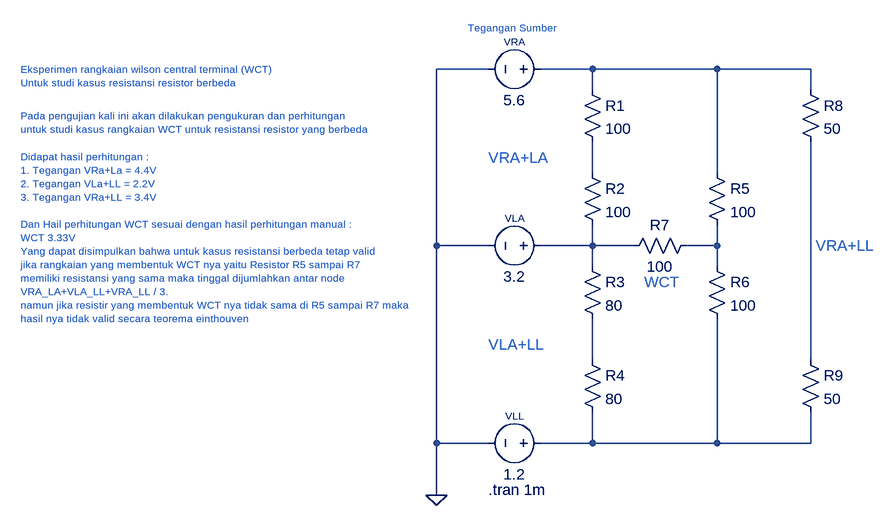
[diagram p0: schematic WCT_dengan_Resistansi_Berbeda.asc]
WCT_dengan_Resistansi_Berbeda.asc, the LTspice schematic file:
Version 4
SHEET 1 880 772
WIRE -96 96 -176 96
WIRE 64 96 -16 96
WIRE 256 96 64 96
WIRE 400 96 256 96
WIRE 64 128 64 96
WIRE 400 128 400 96
WIRE 64 256 64 208
WIRE 256 256 256 96
WIRE -176 368 -176 96
WIRE -96 368 -176 368
WIRE 64 368 64 336
WIRE 64 368 -16 368
WIRE 128 368 64 368
WIRE 256 368 256 336
WIRE 256 368 208 368
WIRE 64 400 64 368
WIRE 256 400 256 368
WIRE 64 544 64 480
WIRE 400 544 400 208
WIRE -176 672 -176 368
WIRE -96 672 -176 672
WIRE 64 672 64 624
WIRE 64 672 -16 672
WIRE 256 672 256 480
WIRE 256 672 64 672
WIRE 400 672 400 624
WIRE 400 672 256 672
WIRE -176 752 -176 672
FLAG -176 752 0
SYMBOL res 48 112 R0
SYMATTR InstName R1
SYMATTR Value 100
SYMBOL res 48 240 R0
SYMATTR InstName R2
SYMATTR Value 100
SYMBOL res 48 384 R0
SYMATTR InstName R3
SYMATTR Value 80
SYMBOL res 48 528 R0
SYMATTR InstName R4
SYMATTR Value 80
SYMBOL res 240 240 R0
SYMATTR InstName R5
SYMATTR Value 100
SYMBOL res 240 384 R0
SYMATTR InstName R6
SYMATTR Value 100
SYMBOL res 224 352 R90
WINDOW 0 0 56 VBottom 2
WINDOW 3 32 56 VTop 2
SYMATTR InstName R7
SYMATTR Value 100
SYMBOL res 384 112 R0
SYMATTR InstName R8
SYMATTR Value 50
SYMBOL res 384 528 R0
SYMATTR InstName R9
SYMATTR Value 50
SYMBOL voltage 0 96 R90
WINDOW 0 -32 56 VBottom 1
WINDOW 3 32 56 VTop 2
SYMATTR InstName VRA
SYMATTR Value 5.6
SYMBOL voltage 0 368 R90
WINDOW 0 -32 56 VBottom 1
WINDOW 3 32 56 VTop 2
SYMATTR InstName VLA
SYMATTR Value 3.2
SYMBOL voltage 0 672 R90
WINDOW 0 -32 56 VBottom 1
WINDOW 3 32 56 VTop 2
SYMATTR InstName VLL
SYMATTR Value 1.2
TEXT -816 96 Left 1 ;Eksperimen rangkaian wilson central terminal (WCT)\nUntuk studi kasus resistansi resistor berbeda
TEXT -128 32 Left 1 ;Tegangan Sumber
TEXT -96 232 Left 2 ;VRA+LA
TEXT -96 520 Left 2 ;VLA+LL
TEXT 408 368 Left 2 ;VRA+LL
TEXT 144 424 Left 2 ;WCT
TEXT -96 744 Left 2 !.tran 1m
TEXT -816 168 Left 1 ;Pada pengujian kali ini akan dilakukan pengukuran dan perhitungan \nuntuk studi kasus rangkaian WCT untuk resistansi resistor yang berbeda\n \nDidapat hasil perhitungan :\n1. Tegangan VRa+La = 4.4V\n2. Tegangan VLa+LL = 2.2V\n3. Tegangan VRa+LL = 3.4V\n \nDan Hail perhitungan WCT sesuai dengan hasil perhitungan manual : \nWCT 3.33V\nYang dapat disimpulkan bahwa untuk kasus resistansi berbeda tetap valid \njika rangkaian yang membentuk WCT nya yaitu Resistor R5 sampai R7 \nmemiliki resistansi yang sama maka tinggal dijumlahkan antar node \nVRA_LA+VLA_LL+VRA_LL / 3. \nnamun jika resistir yang membentuk WCT nya tidak sama di R5 sampai R7 maka \nhasil nya tidak valid secara teorema einthouven

The netlist it stands for:
* WCT_dengan_Resistansi_Berbeda.asc
R1 N001 N002 100
R2 N002 N003 100
R3 N003 N005 80
R4 N005 N007 80
R5 N001 N004 100
R6 N004 N007 100
R7 N004 N003 100
R8 N001 N006 50
R9 N006 N007 50
VRA N001 0 5.6
VLA N003 0 3.2
VLL N007 0 1.2
* Eksperimen rangkaian wilson central terminal (WCT)
* Untuk studi kasus resistansi resistor berbeda
* Tegangan Sumber
* VRA+LA
* VLA+LL
* VRA+LL
* WCT
.tran 1m
* Pada pengujian kali ini akan dilakukan pengukuran dan perhitungan
* untuk studi kasus rangkaian WCT untuk resistansi resistor yang berbeda
* Didapat hasil perhitungan :
* 1. Tegangan VRa+La = 4.4V
* 2. Tegangan VLa+LL = 2.2V
* 3. Tegangan VRa+LL = 3.4V
* Dan Hail perhitungan WCT sesuai dengan hasil perhitungan manual :
* WCT 3.33V
* Yang dapat disimpulkan bahwa untuk kasus resistansi berbeda tetap valid
* jika rangkaian yang membentuk WCT nya yaitu Resistor R5 sampai R7
* memiliki resistansi yang sama maka tinggal dijumlahkan antar node
* VRA_LA+VLA_LL+VRA_LL / 3.
* namun jika resistir yang membentuk WCT nya tidak sama di R5 sampai R7 maka
* hasil nya tidak valid secara teorema einthouven
.backanno
.end